# Altium schematic sheet TheStaticTurtle_oshw-sdi3g-fiber__schematic_V2__Sheet_1_2024-11-17.schdoc
size 279 x 205 mm
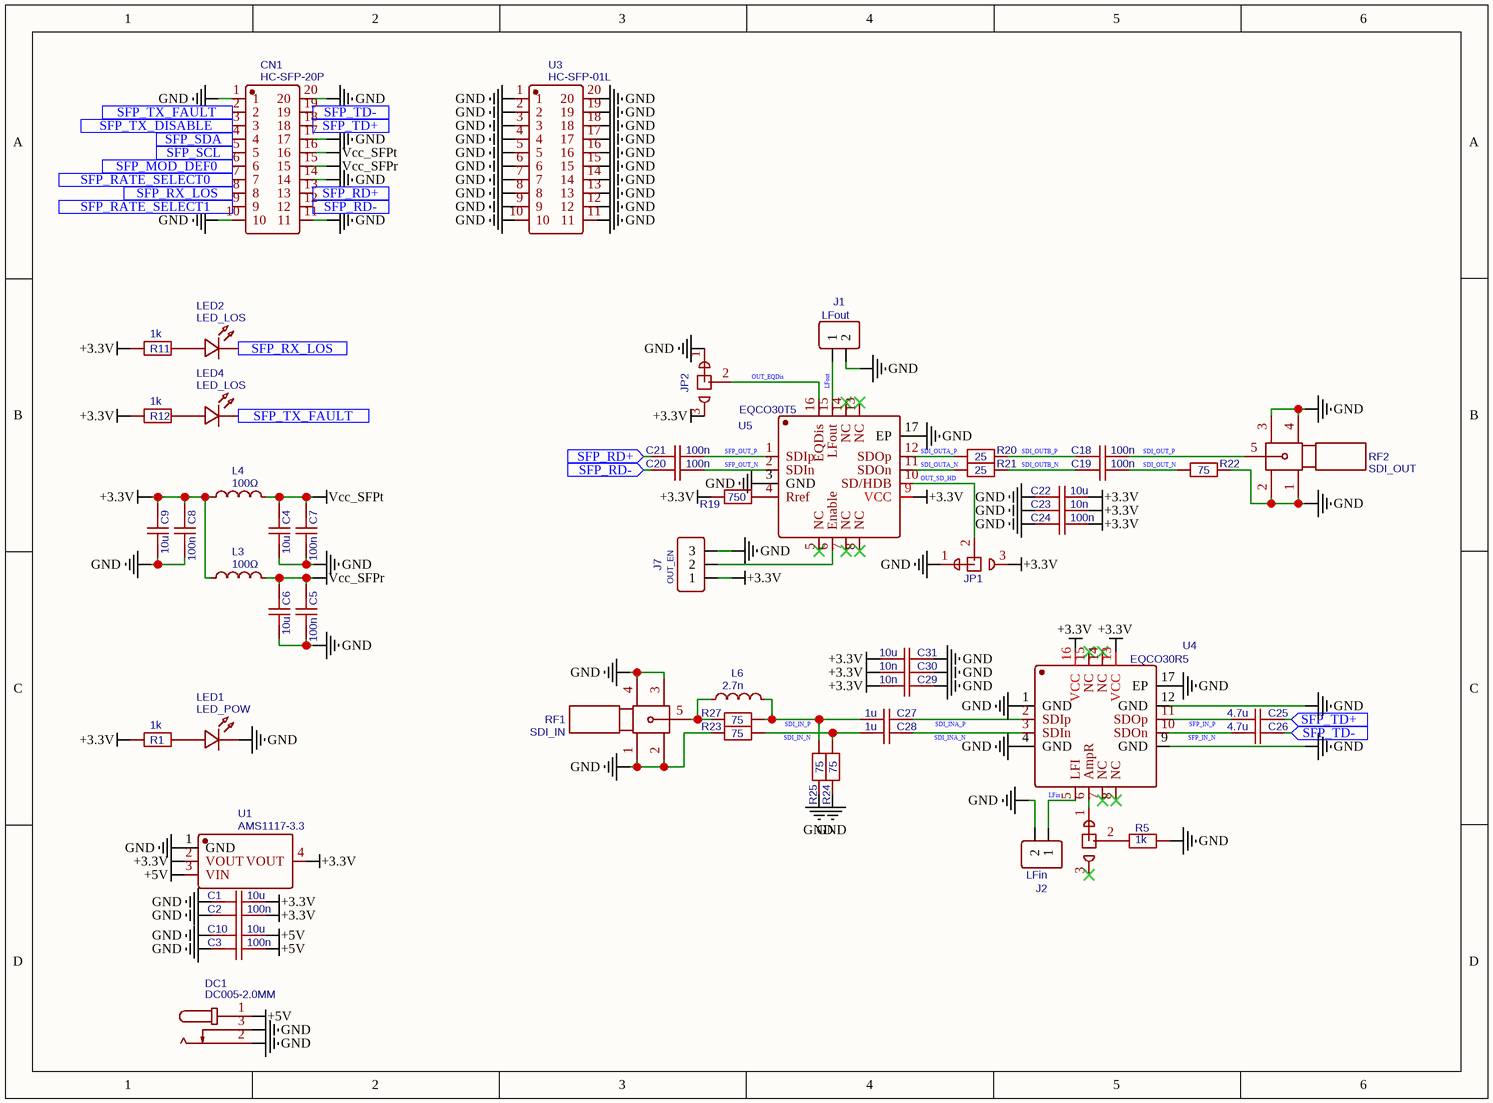
[diagram p0: TheStaticTurtle_oshw-sdi3g-fiber__schematic_V2__Sheet_1_2024-11-17.schdoc]

## Parts
C1  10u  [C0603]
C2  100n  [C0603]
C3  100n  [C0603]
C4  10u  [C0603]
C5  100n  [C0603]
C6  10u  [C0603]
C7  100n  [C0603]
C8  100n  [C0603]
C9  10u  [C0603]
C10  10u  [C0603]
C18  100n  [C0603]
C19  100n  [C0603]
C20  100n  [C0603]
C21  100n  [C0603]
C22  10u  [C0603]
C23  10n  [C0603]
C24  100n  [C0603]
C25  4.7u  [C0603]
C26  4.7u  [C0603]
C27  1u  [C0603]
C28  1u  [C0603]
C29  10n  [C0603]
C30  10n  [C0603]
C31  10u  [C0603]
CN1  HC-SFP-20P  [CONN-SMD_20P-P0.80_HCTL_HC-SFP-20P]
DC1  DC005-2.0MM  [DC-IN-TH_DC005]
J1  LFout  [HDR-M-2.54_1X2]
J2  LFin  [HDR-M-2.54_1X2]
J7  OUT_EN  [HDR-M-2.54_1X3]
JP1  SOLDER BRIDGE 3P Bridged  [SOLDER_BRIDGE_3P_BRIDGED]  (value not drawn)
JP2  SOLDER BRIDGE 3P Bridged  [SOLDER_BRIDGE_3P_BRIDGED]  (value not drawn)
JP3  SOLDER BRIDGE 3P Bridged  [SOLDER_BRIDGE_3P_BRIDGED]  (value not drawn)
L3  100Ω  [L0805]
L4  100Ω  [L0805]
L6  2.7n  [L0603]
LED1  LED_POW  [LED0603_RED]
LED2  LED_LOS  [LED0603_RED]
LED4  LED_LOS  [LED0603_RED]
R1  1k  [R0603]
R5  1k  [R0603]
R11  1k  [R0603]
R12  1k  [R0603]
R19  750  [R0603]
R20  25  [R0603]
R21  25  [R0603]
R22  75  [R0603]
R23  75  [R0603]
R24  75  [R0603]
R25  75  [R0603]
R27  75  [R0603]
RF1  SDI_IN  [SMA-SMD_BWSMA-KE-P001]
RF2  SDI_OUT  [SMA-SMD_BWSMA-KE-P001]
U1  AMS1117-3.3  [SOT-223-3_L6.5-W3.4-P2.30-LS7.0-BR]
U3  HC-SFP-01L  [TH_HC-SFP-01L]
U4  EQCO30R5  [QFN16G-0.65-4X4MM]
U5  EQCO30T5  [QFN16G-0.65-4X4MM]

## Ports
SFP_MOD_DEF0 (in), SFP_RATE_SELECT0 (in), SFP_RATE_SELECT1 (in), SFP_RD+ (in), SFP_RD- (in), SFP_RX_LOS (in), SFP_SCL (in), SFP_SDA (in), SFP_TD+ (in), SFP_TD- (in), SFP_TX_DISABLE (in), SFP_TX_FAULT (in)

## Nets
+3.3V: C1.2 C2.2 C8.2 C9.2 C22.2 C23.2 C24.2 C29.2 C30.2 C31.2 J7.1 JP1.3 JP2.3 L3.1 L4.1 R1.1 R11.1 R12.1 R19.1 U1.2(VOUT) U1.4(VOUT) U4.13(VCC) U4.16(VCC) U5.9(VCC)
+5V: C3.2 C10.2 DC1.1 U1.3(VIN)
GND: C1.1 C2.1 C3.1 C4.1 C5.1 C6.1 C7.1 C8.1 C9.1 C10.1 C22.1 C23.1 C24.1 C29.1 C30.1 C31.1 CN1.1 CN1.10 CN1.11 CN1.14 CN1.17 CN1.20 DC1.2 DC1.3 J1.2 J2.2 J7.3 JP1.1 JP2.1 LED1.2 R5.1 R22.2 R23.2 R24.1 R25.1 RF1.1 RF1.2 RF1.3 RF1.4 RF2.1 RF2.2 RF2.3 RF2.4 U1.1(GND) U3.1 U3.2 U3.3 U3.4 U3.5 U3.6 U3.7 U3.8 U3.9 U3.10 U3.11 U3.12 U3.13 U3.14 U3.15 U3.16 U3.17 U3.18 U3.19 U3.20 U4.1(GND) U4.4(GND) U4.9(GND) U4.12(GND) U4.17(EP) U5.3(GND) U5.17(EP)
Vcc_SFPr: C5.2 C6.2 CN1.15 L3.2
Vcc_SFPt: C4.2 C7.2 CN1.16 L4.2
LFin: J2.1 U4.5(LFI)
LFout: J1.1 U5.15(LFout)
OUT_EQDis: JP2.2 U5.16(EQDis)
OUT_SD_HD: JP1.2 U5.10(SD/HDB)
SDI_IN_N: C28.2 R23.1 R24.2
SDI_IN_P: C27.2 L6.1 R25.2 R27.1
SDI_INA_N: C28.1 U4.3(SDIn)
SDI_INA_P: C27.1 U4.2(SDIp)
SDI_OUT_N: C19.2 R22.1
SDI_OUT_P: C18.2 RF2.5
SDI_OUTA_N: R21.1 U5.11(SDOn)
SDI_OUTA_P: R20.1 U5.12(SDOp)
SDI_OUTB_N: C19.1 R21.2
SDI_OUTB_P: C18.1 R20.2
SFP_IN_N: C26.2 U4.10(SDOn)
SFP_IN_P: C25.2 U4.11(SDOp)
SFP_MOD_DEF0: CN1.6 ; port SFP_MOD_DEF0
SFP_OUT_N: C20.2 U5.2(SDIn)
SFP_OUT_P: C21.2 U5.1(SDIp)
SFP_RATE_SELECT0: CN1.7 ; port SFP_RATE_SELECT0
SFP_RATE_SELECT1: CN1.9 ; port SFP_RATE_SELECT1
SFP_RD+: C21.1 CN1.13 ; port SFP_RD+
SFP_RD-: C20.1 CN1.12 ; port SFP_RD-
SFP_RX_LOS: CN1.8 LED2.2 ; port SFP_RX_LOS
SFP_SCL: CN1.5 ; port SFP_SCL
SFP_SDA: CN1.4 ; port SFP_SDA
SFP_TD+: C25.1 CN1.18 ; port SFP_TD+
SFP_TD-: C26.1 CN1.19 ; port SFP_TD-
SFP_TX_DISABLE: CN1.3 ; port SFP_TX_DISABLE
SFP_TX_FAULT: CN1.2 LED4.2 ; port SFP_TX_FAULT
NetJ7_2: J7.2 U5.6(Enable)
NetJP3_1: JP3.1 U4.6(AmpR)
NetJP3_2: JP3.2 R5.2
NetL6_2: L6.2 R27.2 RF1.5
NetLED1_1: LED1.1 R1.2
NetLED2_1: LED2.1 R11.2
NetLED4_1: LED4.1 R12.2
NetR19_2: R19.2 U5.4(Rref)

Not connected (* = marked no-connect by the designer): JP3 3*; U4 7(NC)* 8(NC)* 14(NC)* 15(NC)*; U5 5(NC)* 7(NC)* 8(NC)* 13(NC)* 14(NC)*

## Library data of the parts
C1 C4 C6 C9 C10 C22 C31 = 10u: nameAlias: Value(F); Contributor: LCEDA_Lib; spicePre: C; spiceSymbolName: C_0603_US
C2 C3 C5 C7 C8 C18-C21 C24 = 100n: nameAlias: Value(F); Contributor: LCEDA_Lib; spicePre: C; spiceSymbolName: C_0603_US
C23 C29 C30 = 10n: nameAlias: Value(F); Contributor: LCEDA_Lib; spicePre: C; spiceSymbolName: C_0603_US
C25 C26 = 4.7u: nameAlias: Value(F); Contributor: LCEDA_Lib; spicePre: C; spiceSymbolName: C_0603_US
C27 C28 = 1u: nameAlias: Value(F); Contributor: LCEDA_Lib; spicePre: C; spiceSymbolName: C_0603_US
CN1 = HC-SFP-20P: Manufacturer: HCTL(华灿天禄); Contributor: LCSC; Supplier: LCSC; Supplier Part: C2897291; Manufacturer Part: HC-SFP-20P; JLCPCB Part Class: Extended Part; spicePre: C; spiceSymbolName: HC-SFP-20P
DC1 = DC005-2.0MM: Manufacturer: SOFNG; Supplier: LCSC; Manufacturer Part: DC005-2.0MM; Supplier Part: C111567; spicePre: D; spiceSymbolName: DC005-2.0MM
J1 = LFout: Contributor: LCEDA_Lib; Supplier Part: C124375; Supplier: LCSC; spicePre: J; spiceSymbolName: HDR-M-2.54_1x2
J2 = LFin: Contributor: LCEDA_Lib; Supplier Part: C124375; Supplier: LCSC; spicePre: J; spiceSymbolName: HDR-M-2.54_1x2
J7 = OUT_EN: Contributor: LCEDA_Lib; Supplier Part: C180248; Supplier: LCSC; spicePre: J; spiceSymbolName: HDR-M-2.54_1x3
JP1-JP3 = SOLDER BRIDGE 3P Bridged: Contributor: softmachine; spicePre: J; spiceSymbolName: SOLDER BRIDGE
L3 L4 = 100Ω: Manufacturer: Sunlord(顺络); Manufacturer Part: GZ2012D101TF; nameAlias: Value; Supplier: LCSC; Supplier Part: C1015; JLCPCB Part Class: Basic Part; spicePre: L; spiceSymbolName: GZ2012D101TF
L6 = 2.7n: nameAlias: Value(H); Contributor: LCEDA_Lib; spicePre: L; spiceSymbolName: L0603_US
LED1 = LED_POW: Manufacturer: EVERLIGHT(台湾亿光); Manufacturer Part: 19-217/R6C-AL1M2VY/3T; Contributor: LCEDA_01; Supplier Part: C72044; Supplier: LCSC; spicePre: L; spiceSymbolName: LED-0603_R
LED2 LED4 = LED_LOS: Manufacturer: EVERLIGHT(台湾亿光); Manufacturer Part: 19-217/R6C-AL1M2VY/3T; Contributor: LCEDA_01; Supplier Part: C72044; Supplier: LCSC; spicePre: L; spiceSymbolName: LED-0603_R
R1 R5 R11 R12 = 1k: nameAlias: Value(Ω); Contributor: LCEDA_Lib; spicePre: R; spiceSymbolName: R_0603_EU
R19 = 750: nameAlias: Value(Ω); Contributor: LCEDA_Lib; spicePre: R; spiceSymbolName: R_0603_EU
R20 R21 = 25: nameAlias: Value(Ω); Contributor: LCEDA_Lib; spicePre: R; spiceSymbolName: R_0603_EU
R22-R25 R27 = 75: nameAlias: Value(Ω); Contributor: LCEDA_Lib; spicePre: R; spiceSymbolName: R_0603_EU
RF1 = SDI_IN: Manufacturer: BAT WIRELESS; Manufacturer Part: BWSMA-KE-P001; Contributor: ytahn23; Supplier: LCSC; Supplier Part: C496550; spicePre: R; spiceSymbolName: BWSMA-KE-P001
RF2 = SDI_OUT: Manufacturer: BAT WIRELESS; Manufacturer Part: BWSMA-KE-P001; Contributor: ytahn23; Supplier: LCSC; Supplier Part: C496550; spicePre: R; spiceSymbolName: BWSMA-KE-P001
U1 = AMS1117-3.3: Manufacturer: AMS; sourceId: dwIGgezVh; timeStamp: 1476261164; Supplier: LCSC; Manufacturer Part: AMS1117-3.3; Supplier Part: C6186; JLCPCB Part Class: Basic Part; spicePre: U; spiceSymbolName: AMS1117-3.3
U3 = HC-SFP-01L: Manufacturer: HCTL(华灿天禄); Contributor: LCSC; Supplier: LCSC; Supplier Part: C2897292; Manufacturer Part: HC-SFP-01L; JLCPCB Part Class: Extended Part; spicePre: U; spiceSymbolName: HC-SFP-01L
U4 = EQCO30R5: Manufacturer: Microchip; Contributor: turtleforgaming; Manufacturer Part: EQCO30R5; link: https://www.microchip.com/en-us/product/eqco30r5; spicePre: U; spiceSymbolName: EQCO30R5
U5 = EQCO30T5: Manufacturer: Microchip; Contributor: turtleforgaming; Manufacturer Part: EQCO30T5; link: https://www.microchip.com/en-us/product/eqco30r5; spicePre: U; spiceSymbolName: EQCO30T5